# EasyEDA schematic 1-Schematic_INFRARED_WAVER_V1.json
TITLE: Sheet_1; REV: 1.0; Date: 2022-12-25; Sheet: 1/1; Drawn By: maarnotto; Company: Your Company
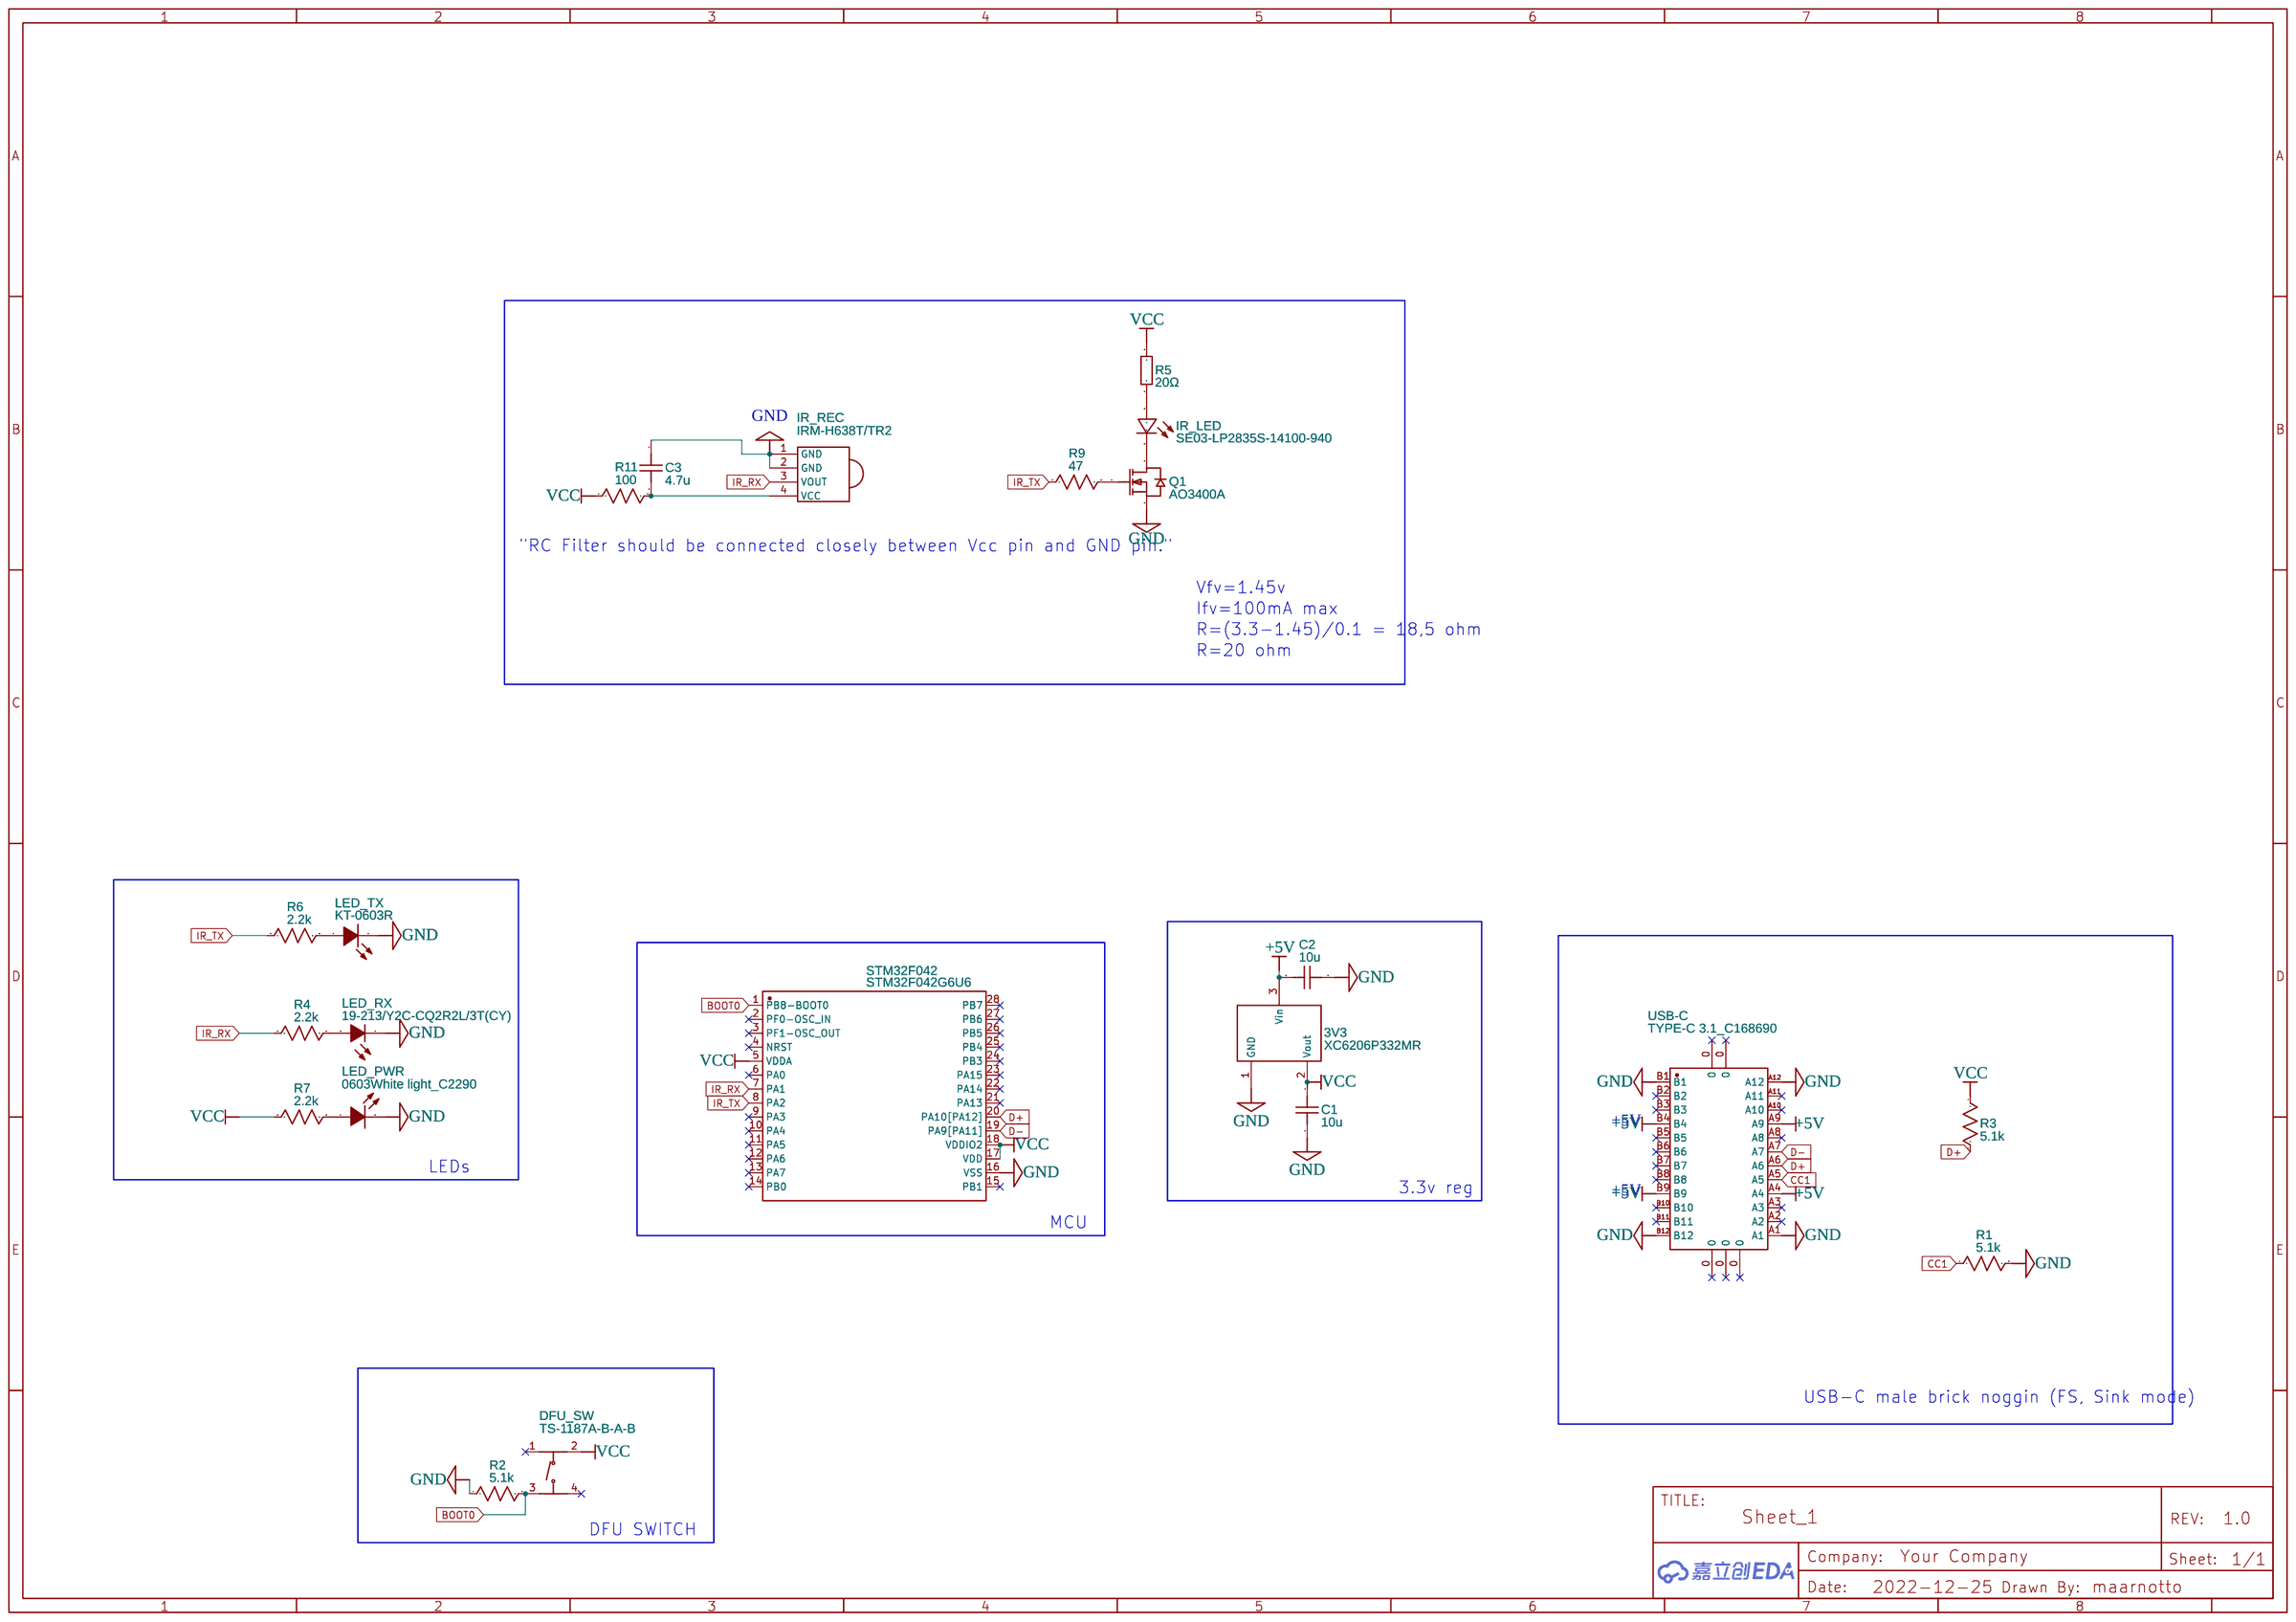
[diagram p0: schematic sheet]

## Parts
3V3  XC6206P332MR  [SOT-23-3_L2.9-W1.6-P1.90-LS2.8-BR]
C1  10u  [C0603]
C2  10u  [C0603]
C3  4.7u  [C0603]
DFU_SW  TS-1187A-B-A-B  [SW-SMD_4P-L5.1-W5.1-P3.70-LS6.5-TL-2]
IR_LED  SE03-LP2835S-14100-940  [SENSOR-SMD_L3.5-W2.8-FD]
IR_REC  IRM-H638T/TR2  [SENSOR-SMD_IRM-H638T-TR2-TL]
LED_PWR  0603White light_C2290  [LED0603-R-RD_WHITE]
LED_RX  19-213/Y2C-CQ2R2L/3T(CY)  [LED0603-RD-YELLOW]
LED_TX  KT-0603R  [LED0603-RD]
Q1  AO3400A  [SOT-23-3_L2.9-W1.6-P1.90-LS2.8-BR]
R1  5.1k  [R0603]
R2  5.1k  [R0603]
R3  5.1k  [R0603]
R4  2.2k  [R0603]
R5  20Ω  [R1206]
R6  2.2k  [R0603]
R7  2.2k  [R0603]
R9  47  [R0603]
R11  100  [R0603]
STM32F042  STM32F042G6U6  [UFQFPN-28_L4.0-W4.0-P0.50-BL]
USB-C  TYPE-C 3.1_C168690  [USB-C-SMD_TYPE-C-USB-3]

## Library data of the parts
3V3 = XC6206P332MR: Supplier: LCSC; Manufacturer: TOREX(特瑞仕); Supplier Part: C5446; JLCPCB Part Class: Basic Part
C1-C3 = C_0603_US: Contributor: LCEDA_Lib
DFU_SW = TS-1187A-B-A-B: Supplier: LCSC; Supplier Part: C318884; Manufacturer: XKB Connectivity(中国星坤); Contributor: LCSC; JLCPCB Part Class: Basic Part
IR_LED = SE03-LP2835S-14100-940: Contributor: lcsc; Supplier: LCSC; Supplier Part: C5205247; Manufacturer: XSSY(旭晟); JLCPCB Part Class: Extended Part
IR_REC = IRM-H638T/TR2: Supplier: LCSC; Manufacturer: EVERLIGHT(亿光); Supplier Part: C91447; JLCPCB Part Class: Extended Part
LED_PWR = 0603White light_C2290: Supplier: LCSC; Manufacturer: null; Manufacturer Part: KT-0603白灯; Supplier Part: C2290; JLCPCB Part Class: Basic Part
LED_RX = 19-213/Y2C-CQ2R2L/3T(CY): Supplier: LCSC; Manufacturer: EVERLIGHT(亿光); Supplier Part: C72038; JLCPCB Part Class: Basic Part
LED_TX = KT-0603R: Supplier: LCSC; Manufacturer: KENTO; Supplier Part: C2286; JLCPCB Part Class: Basic Part
Q1 = AO3400A: Supplier: LCSC; Manufacturer: AOS; Supplier Part: C20917; JLCPCB Part Class: Basic Part
R1-R4 R6 R7 R9 R11 = R_0603_US: Contributor: LCEDA_Lib
R5 = 1206W4F200JT5E: Supplier: LCSC; Manufacturer: UNI-ROYAL(厚声); Supplier Part: C17955; JLCPCB Part Class: Basic Part
STM32F042 = STM32F042G6U6: Contributor: LCSC; Supplier: LCSC; Supplier Part: C961597; Manufacturer: ST(意法半导体); JLCPCB Part Class: Extended Part
USB-C = TYPE-C 3.1_C168690: Contributor: 立创EDA官方封装库; Supplier: LCSC; Supplier Part: C168690; Manufacturer: 精拓金; Manufacturer Part: 918-118A2021Y40000; JLCPCB Part Class: Extended Part

## Nets
+5V: 3V3.3(Vin) C2.2 USB-C.A4 USB-C.A9 USB-C.B4 USB-C.B9
GND: 3V3.1(GND) C1.2 C2.1 C3.1 IR_REC.1(GND) IR_REC.2(GND) LED_PWR.2(K) LED_RX.1(C) LED_TX.1(K) Q1.2(S) R1.2 R2.1 STM32F042.16(VSS) USB-C.A1 USB-C.A12 USB-C.B1 USB-C.B12
VCC: 3V3.2(Vout) C1.1 DFU_SW.2(B) R3.1 R5.1 R7.1 R11.1 STM32F042.5(VDDA) STM32F042.17(VDD) STM32F042.18(VDDIO2)
BOOT0: DFU_SW.3(C) R2.2 STM32F042.1(PB8-BOOT0)
CC1: R1.1 USB-C.A5
D+: R3.2 STM32F042.20(PA10[PA12]) USB-C.A6
D-: STM32F042.19(PA9[PA11]) USB-C.A7
IR_RX: IR_REC.3(VOUT) R4.1 STM32F042.7(PA1)
IR_TX: R6.1 R9.1 STM32F042.8(PA2)
Net-(C3-2): C3.2 IR_REC.4(VCC) R11.2
Net-(IR_LED-1): IR_LED.1(A) R5.2
Net-(IR_LED-2): IR_LED.2(C) Q1.3(D)
Net-(LED_PWR-1): LED_PWR.1(A) R7.2
Net-(LED_RX-2): LED_RX.2(A) R4.2
Net-(LED_TX-2): LED_TX.2(A) R6.2
Net-(Q1-1): Q1.1(G) R9.2

Not connected (* = marked no-connect by the designer): DFU_SW 1(A)* 4(D)*; STM32F042 2(PF0-OSC_IN)* 3(PF1-OSC_OUT)* 4(NRST)* 6(PA0)* 9(PA3)* 10(PA4)* 11(PA5)* 12(PA6)* 13(PA7)* 14(PB0)* 15(PB1)* 21(PA13)* 22(PA14)* 23(PA15)* 24(PB3)* 25(PB4)* 26(PB5)* 27(PB6)* 28(PB7)*; USB-C 0* A2* A3* A8* A10* A11* B2* B3* B5* B6* B7* B8* B10* B11*

## Notes on the sheet
- "RC Filter should be connected closely between Vcc pin and GND pin."
- Vfv=1.45v
- Ifv=100mA max
- R=(3.3-1.45)/0.1 = 18,5 ohm
- R=20 ohm
- +5V
- LEDs
- 3.3v reg
- +5V
- MCU
- USB-C male brick noggin (FS, Sink mode)
- DFU SWITCH
